# Altium schematic sheet 17 GPS MODULE.SchDoc
size 513 x 386 mm
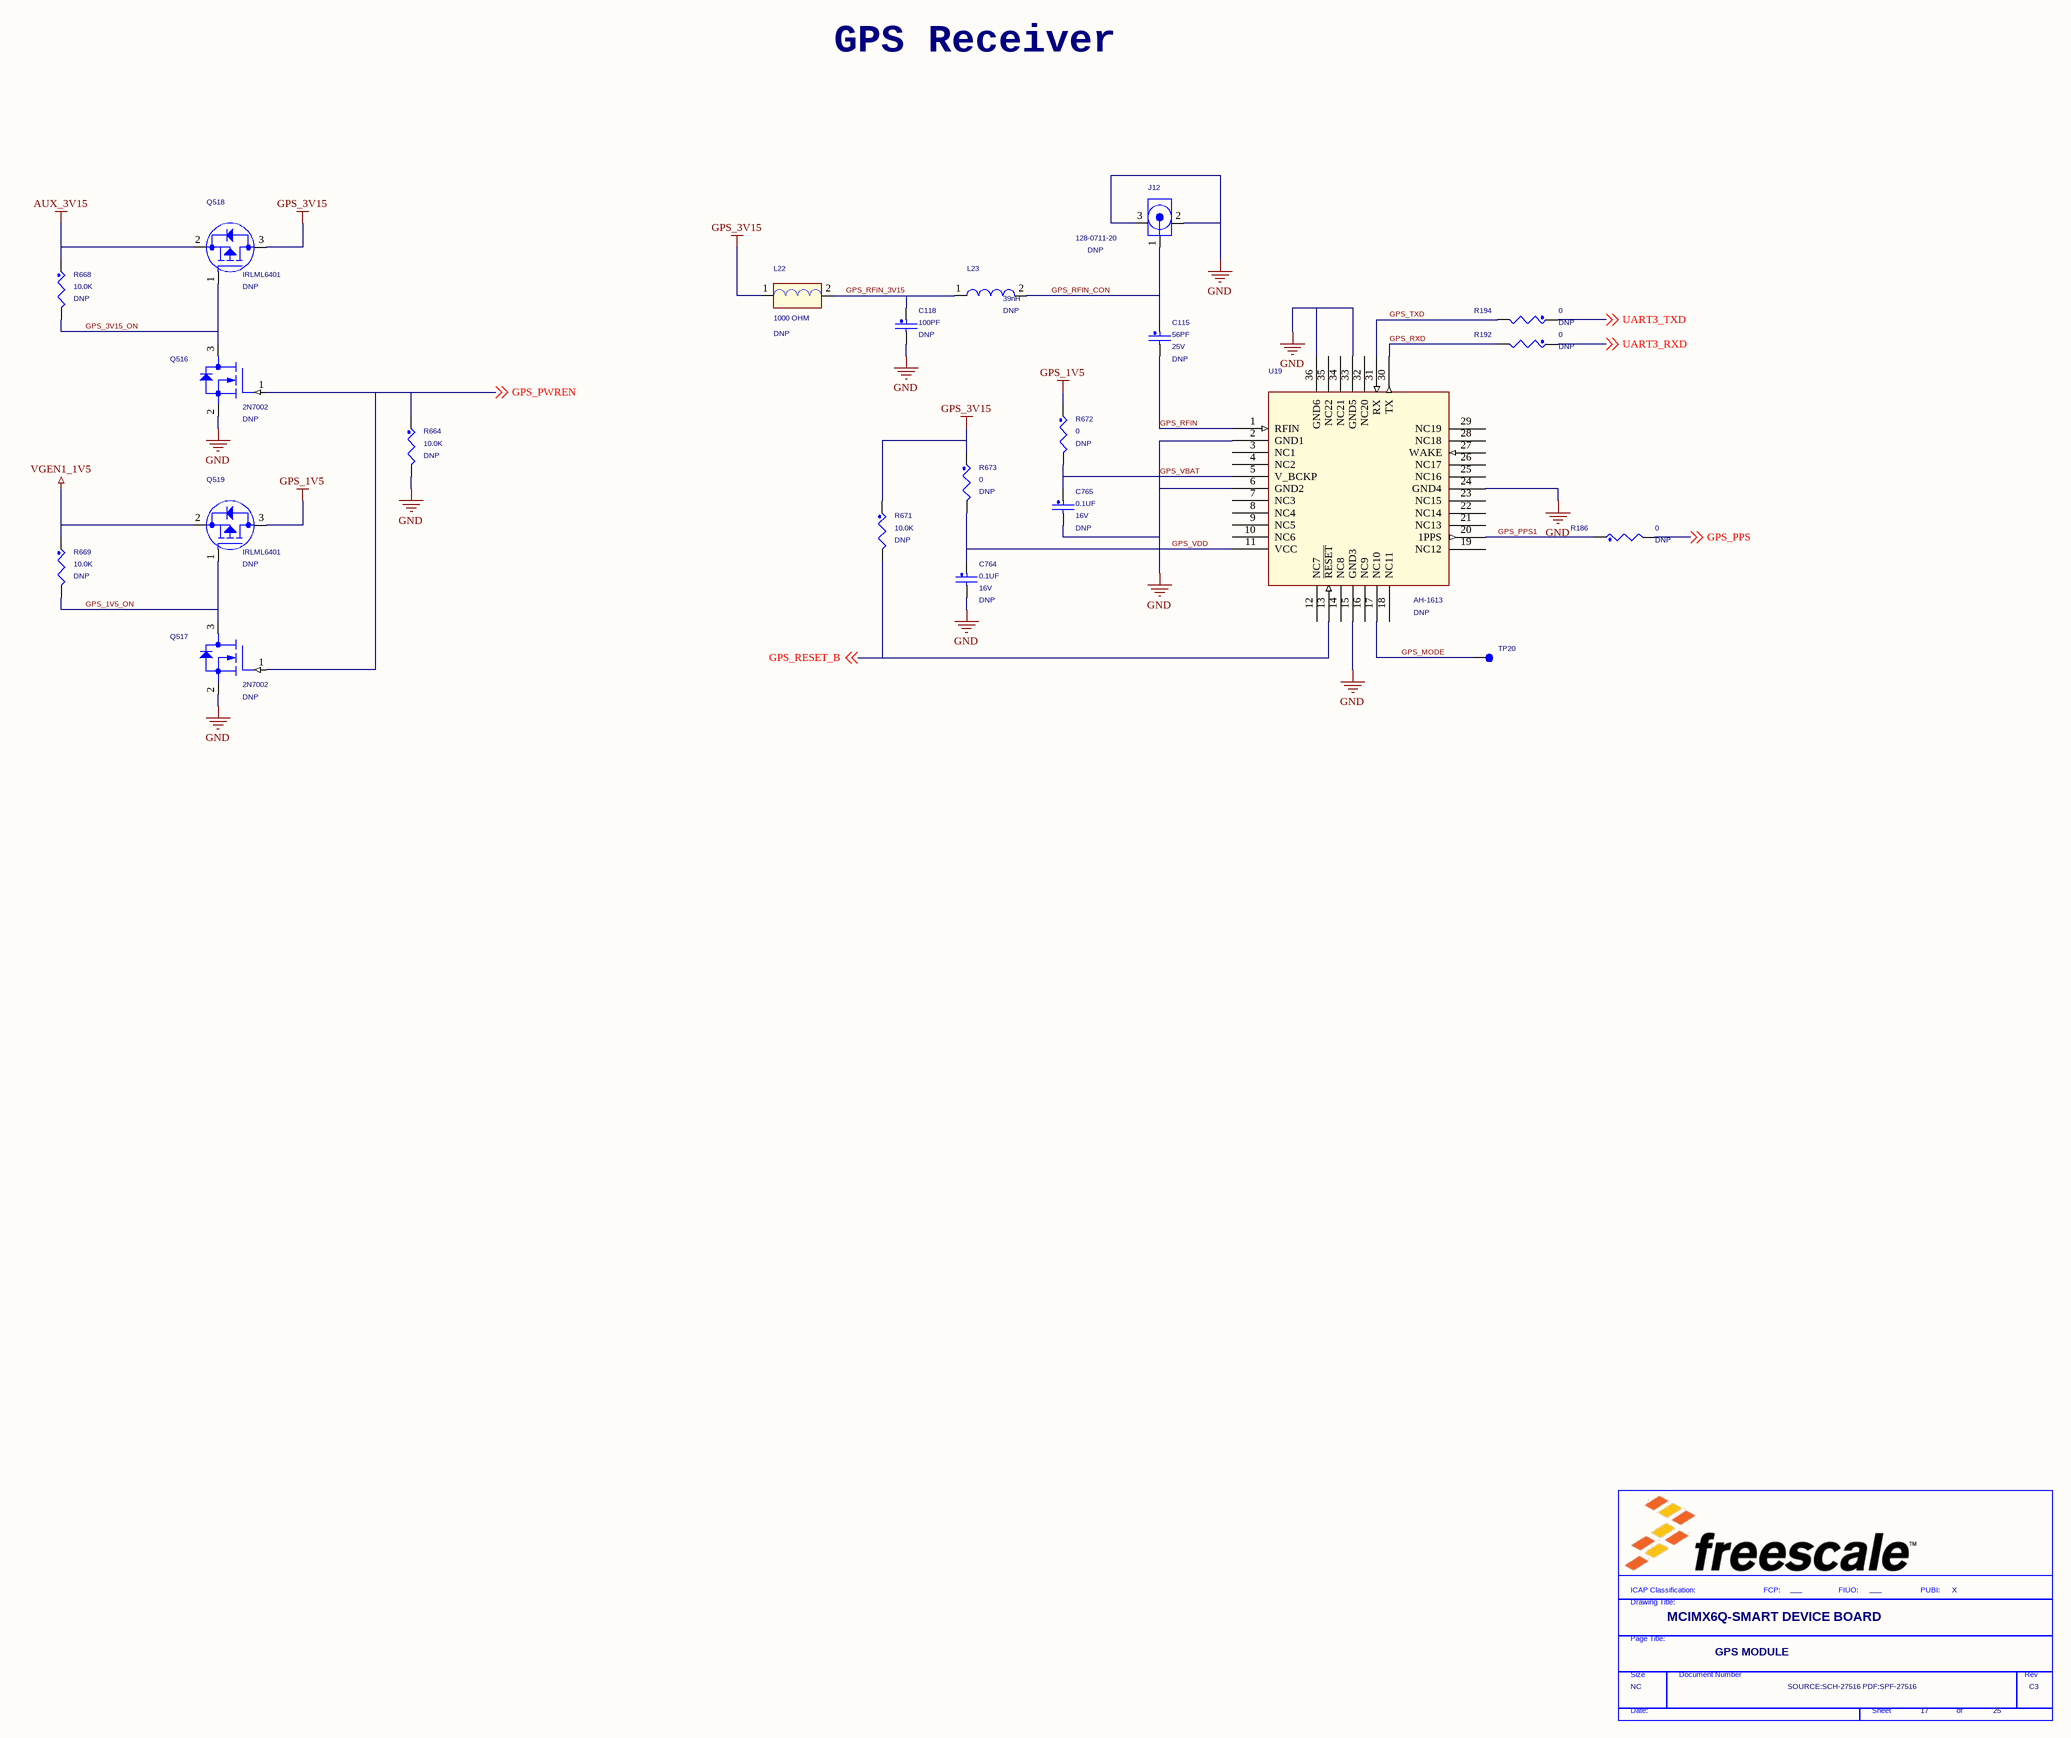
[diagram p0: 17 GPS MODULE.SchDoc]

## Parts
*  FIUO: ___  PUBI: X  Doc: SOURCE:SCH-27516 PDF:SPF-27516  RevCode: C3  Title: MCIMX6Q-SMART DEVICE BOARD  Page Size: NC  Page Number: 17  Page Count: 25  PageTitle: GPS MODULE  (hidden comment: TitleBlock_FS)  (graphical)
C115  56PF  ASSY_OPT: DNP  WVDC: 25V  [0201_CC]
C118  100PF  ASSY_OPT: DNP  [0402_CC]
C764  0.1UF  ASSY_OPT: DNP  WVDC: 16V  [0402_CC]
C765  0.1UF  WVDC: 16V  ASSY_OPT: DNP  [0402_CC]
J12  128-0711-20  ASSY_OPT: DNP  [con3_ver_smt]
L22  1000 OHM  ASSY_OPT: DNP  [0402_CC]
L23  39nH  ASSY_OPT: DNP  [0402_CC]
Q516  2N7002  ASSY_OPT: DNP  [SOT23]
Q517  2N7002  ASSY_OPT: DNP  [SOT23]
Q518  IRLML6401  ASSY_OPT: DNP  [sot-23]
Q519  IRLML6401  ASSY_OPT: DNP  [sot-23]
R186  0  ASSY_OPT: DNP  [0402_CC]
R192  0  ASSY_OPT: DNP  [0402_CC]
R194  0  ASSY_OPT: DNP  [0402_CC]
R664  10.0K  ASSY_OPT: DNP  [0402_CC]
R668  10.0K  ASSY_OPT: DNP  [0402_CC]
R669  10.0K  ASSY_OPT: DNP  [0402_CC]
R671  10.0K  ASSY_OPT: DNP  [0402_CC]
R672  0  ASSY_OPT: DNP  [0402_CC]
R673  0  ASSY_OPT: DNP  [0402_CC]
TP20  TEST POINT  [C035S]  (value not drawn)
U19  AH-1613  ASSY_OPT: DNP  [MODULE_AH-1613]

## Nets
AUX_3V15: Q518.2(SOURCE) R668.1
GPS_1V5: Q519.3(DRAIN) R672.1
GPS_3V15: L22.1 Q518.3(DRAIN) R671.1 R673.1
GPS_VBAT: C118.2 C764.2 C765.1 C765.2 J12.2(SHIELD1) J12.3(SHIELD2) Q516.2(SOURCE) Q517.2(SOURCE) R664.2 R672.2 U19.2(GND1) U19.5(V_BCKP) U19.6(GND2) U19.15(GND3) U19.24(GND4) U19.33(GND5) U19.36(GND6)  [also labelled GND]
VGEN1_1V5: Q519.2(SOURCE) R669.1
GPS_1V5_ON: Q517.3(DRAIN) Q519.1(GATE) R669.2
GPS_3V15_ON: Q516.3(DRAIN) Q518.1(GATE) R668.2
GPS_MODE: TP20.1(Pin1) U19.17(NC10)
GPS_PPS: R186.2 ; off-sheet GPS_PPS
GPS_PPS1: R186.1 U19.20(1PPS)
GPS_PWREN: Q516.1(GATE) Q517.1(GATE) R664.1 ; off-sheet GPS_PWREN
GPS_RESET_B: R671.2 U19.13(~{RESET}) ; off-sheet GPS_RESET_B
GPS_RFIN: C115.2 U19.1(RFIN)
GPS_RFIN_3V15: C118.1 L22.2 L23.1
GPS_RFIN_CON: C115.1 J12.1(CENTER) L23.2
GPS_RXD: R192.2 U19.30(TX)
GPS_TXD: R194.2 U19.31(RX)
GPS_VDD: C764.1 R673.2 U19.11(VCC)
UART3_RXD: R192.1 ; off-sheet UART3_RXD
UART3_TXD: R194.1 ; off-sheet UART3_TXD

Not connected (* = marked no-connect by the designer): U19 3(NC1) 4(NC2) 7(NC3) 8(NC4) 9(NC5) 10(NC6) 12(NC7) 14(NC8) 16(NC9) 18(NC11) 19(NC12) 21(NC13) 22(NC14) 23(NC15) 25(NC16) 26(NC17) 27(WAKE) 28(NC18) 29(NC19) 32(NC20) 34(NC21) 35(NC22)

## Notes on the sheet
- GPS Receiver
- (in symbol TitleBlock_FS) ICAP Classification:; FCP:; FIUO:; PUBI:; Drawing Title:; Page Title:; Size; Document Number; Rev; Date:; Sheet; of

## Library data of the parts
* = TitleBlock_FS: OrgAddr2: Austin, TX 78735-8598; OrgAddr1: 6501 William Cannon Drive West; OrgName: Freescale Semiconductor; FCP: ___; Page Create Date: March  8, 1995
C115 = CAP_NP: CAP CER 56PF 25V 5% C0G CC0201; CLASS: DISCRETE; SIGNAL_MODEL: DEFAULT_CAPACITOR_56pF_2_1; FPLIST: CC0201,CC0201_HD,0201_CC; CAD_APPROVED: Yes; MFG_PN01: GRM0335C1E560JD01D; MFG_NAME01: MURATA; AGILE_PN: 150-76810; HEIGHT: 0.33MM; ROHS: Yes; Tolerance: 5%; VOLTAGE: 25V
C118 = CAP_NP: CAP CER 100PF 50V 5% C0G 0402; CLASS: DISCRETE; SIGNAL_MODEL: DEFAULT_CAPACITOR_100pF_2_1; AGILE_PN: 150-30247; MFG_NAME01: KEMET; MFG_PN01: C0402C101J5GAC; CAD_APPROVED: Yes; FPLIST: CC0402_25,CC0402_HD,0402_CC; Tolerance: 5%; ROHS: Yes; HEIGHT: 0.55MM; VOLTAGE: 50V
C764 C765 = CAP_NP: CAP CER 0.1UF 16V 10% X7R 0402; CLASS: DISCRETE; SIGNAL_MODEL: DEFAULT_CAPACITOR_100000pF_2_1; FPLIST: CC0402_25,CC0402_HD,0402_CC; CAD_APPROVED: Yes; MFG_PN01: C0402C104K4RAC; MFG_NAME01: KEMET; AGILE_PN: 150-75182; HEIGHT: 0.635MM; ROHS: Yes; Tolerance: 10%; VOLTAGE: 16V
J12 = CONN_UMC_3P_M: CON 1 UMC SKT SMT -- 49H AU --; CLASS: IO; CAD_APPROVED: Yes; MFG_PN01: 128-0711-201; MFG_NAME01: Emerson Network Power Connectivity Solutions, Inc; AGILE_PN: 211-78991; HEIGHT: 1.25MM; ROHS: Yes
L22 = BEAD: IND FER BEAD 1000 OHM@100MHZ 200MA 25% 0402; PART_TYPE: FERRITE\BEAD; CLASS: DISCRETE; FPLIST: IND_0402,0402_CC; CAD_APPROVED: Yes; MFG_PN01: BLM15AG102SN1D; MFG_NAME01: Murata; AGILE_PN: 180-76937; HEIGHT: 0.55MM; ROHS: Yes
L23 = INDUCTOR: IND -- 0.039UH@100MHZ 250MA 5% 0402; PART_TYPE: COIL; CLASS: DISCRETE; SIGNAL_MODEL: DEFAULT_INDUCTOR_39nH_2_1; FPLIST: IND_0402,0402_CC; CAD_APPROVED: Yes; MFG_PN01: LQW15AN39NJ00D; MFG_NAME01: MURATA; AGILE_PN: 180-75815; HEIGHT: 0.6MM; ROHS: Yes; Tolerance: 5%
Q516 Q517 = 2N7002: TRAN NMOS 60V 115MA SOT23; CLASS: IC; AGILE_PN: 480-75159; MFG_NAME01: ON SEMICONDUCTOR; MFG_PN01: 2N7002LT1G; CAD_APPROVED: Yes; ROHS: Yes; HEIGHT: 1.3MM
Q518 Q519 = MOSFET_P: TRAN PMOS PWR 12V 4.3A SOT23; CLASS: IC; AGILE_PN: 480-77718; MFG_NAME01: INTERNATIONAL RECTIFIER; MFG_PN01: IRLML6401TRPBF; CAD_APPROVED: Yes; ROHS: Yes; HEIGHT: 1.12MM
R186 R192 R194 = RES: RES MF ZERO OHM 1/10W -- 0402; CLASS: DISCRETE; SIGNAL_MODEL: DEFAULT_RESISTOR_0.001OHM_2_1; FPLIST: RC0402_25,RC0402_HD,RC0402_X2,0402_CC; CAD_APPROVED: Yes; MFG_PN01: ERJ-2GE0R00X; MFG_NAME01: Panasonic; AGILE_PN: 470-79965; ROHS: Yes
R664 R671 = RES: RES MF 10.0K 1/16W 1% 0402; CLASS: DISCRETE; SIGNAL_MODEL: DEFAULT_RESISTOR_10000OHM_2_1; AGILE_PN: 470-75416; MFG_NAME01: VISHAY INTERTECHNOLOGY; MFG_PN01: CRCW040210K0FKED; CAD_APPROVED: Yes; FPLIST: RC0402_25,RC0402_HD,0402_CC; Tolerance: 1%; ROHS: Yes
R668 R669 = RES: RES MF 10.0K 1/16W 1% 0402; CLASS: DISCRETE; SIGNAL_MODEL: DEFAULT_RESISTOR_10000OHM_2_1; FPLIST: RC0402_25,RC0402_HD,0402_CC; CAD_APPROVED: Yes; MFG_PN01: CRCW040210K0FKED; MFG_NAME01: VISHAY INTERTECHNOLOGY; AGILE_PN: 470-75416; ROHS: Yes; Tolerance: 1%
R672 R673 = RES: RES MF ZERO OHM 1/10W -- 0402; CLASS: DISCRETE; SIGNAL_MODEL: DEFAULT_RESISTOR_0.001OHM_2_1; AGILE_PN: 470-79965; MFG_NAME01: Panasonic; MFG_PN01: ERJ-2GE0R00X; CAD_APPROVED: Yes; FPLIST: RC0402_25,RC0402_HD,RC0402_X2,0402_CC; ROHS: Yes
TP20 = Test pad: TEST POINT PAD 35 MIL SMT, NO PART TO ORDER; CLASS: IC; CAD_APPROVED: Yes; ASSY_OPT: DNP; MFG_PN01: NA; AGILE_PN: 280-75148; HEIGHT: 0.1 MM; ROHS: Yes; MFG_NAME01: NA
U19 = MODULE_AH-1613: IC GPS RCVR MODULE 2.7-3.6V SMT; AGILE_PN: 312-79936; MFG_NAME01: LOCOSYS TECHNOLOGY INC; CAD_APPROVED: Yes; CLASS: IC; MFG_PN01: AH-1613; ROHS: Yes; HEIGHT: 2.35MM